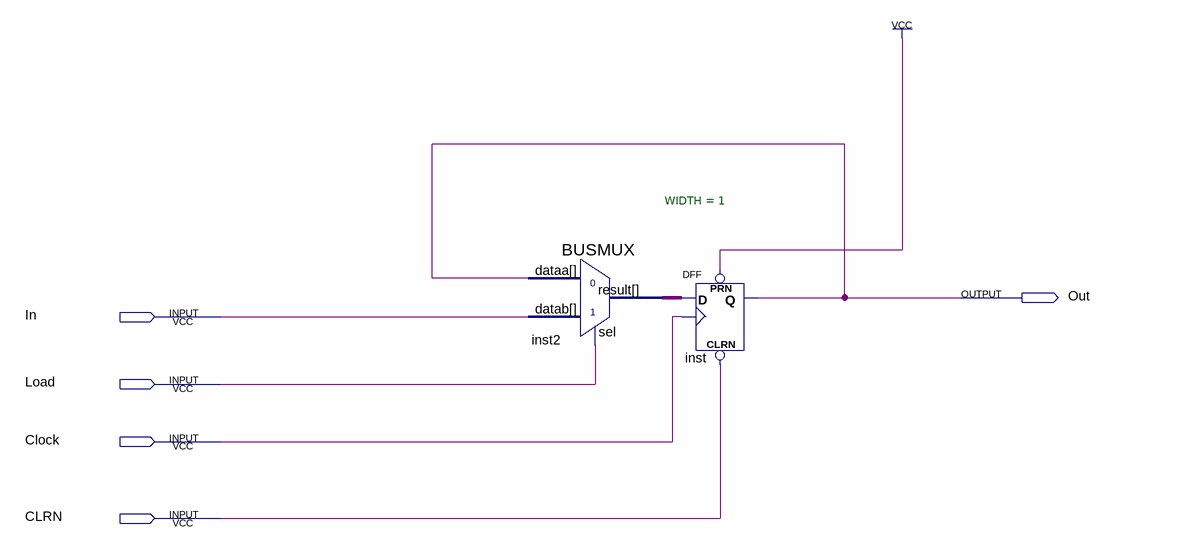
[diagram p0: schematic sheet]
// Quartus schematic register.bdf as structural Verilog: 2 symbols, 5 pins
module register (
  input  In,
  input  Load,
  input  Clock,
  input  CLRN,
  output Out
);

  wire inst2_result;

  BUSMUX #(.WIDTH(1)) inst2 (.datab(In), .sel(Load), .dataa(Out), .result(inst2_result));
  DFF inst (.CLRN(CLRN), .CLK(Clock), .D(inst2_result), .PRN(1'b1), .Q(Out));
endmodule
